# Altium project XRACER-R07.PrjPCB
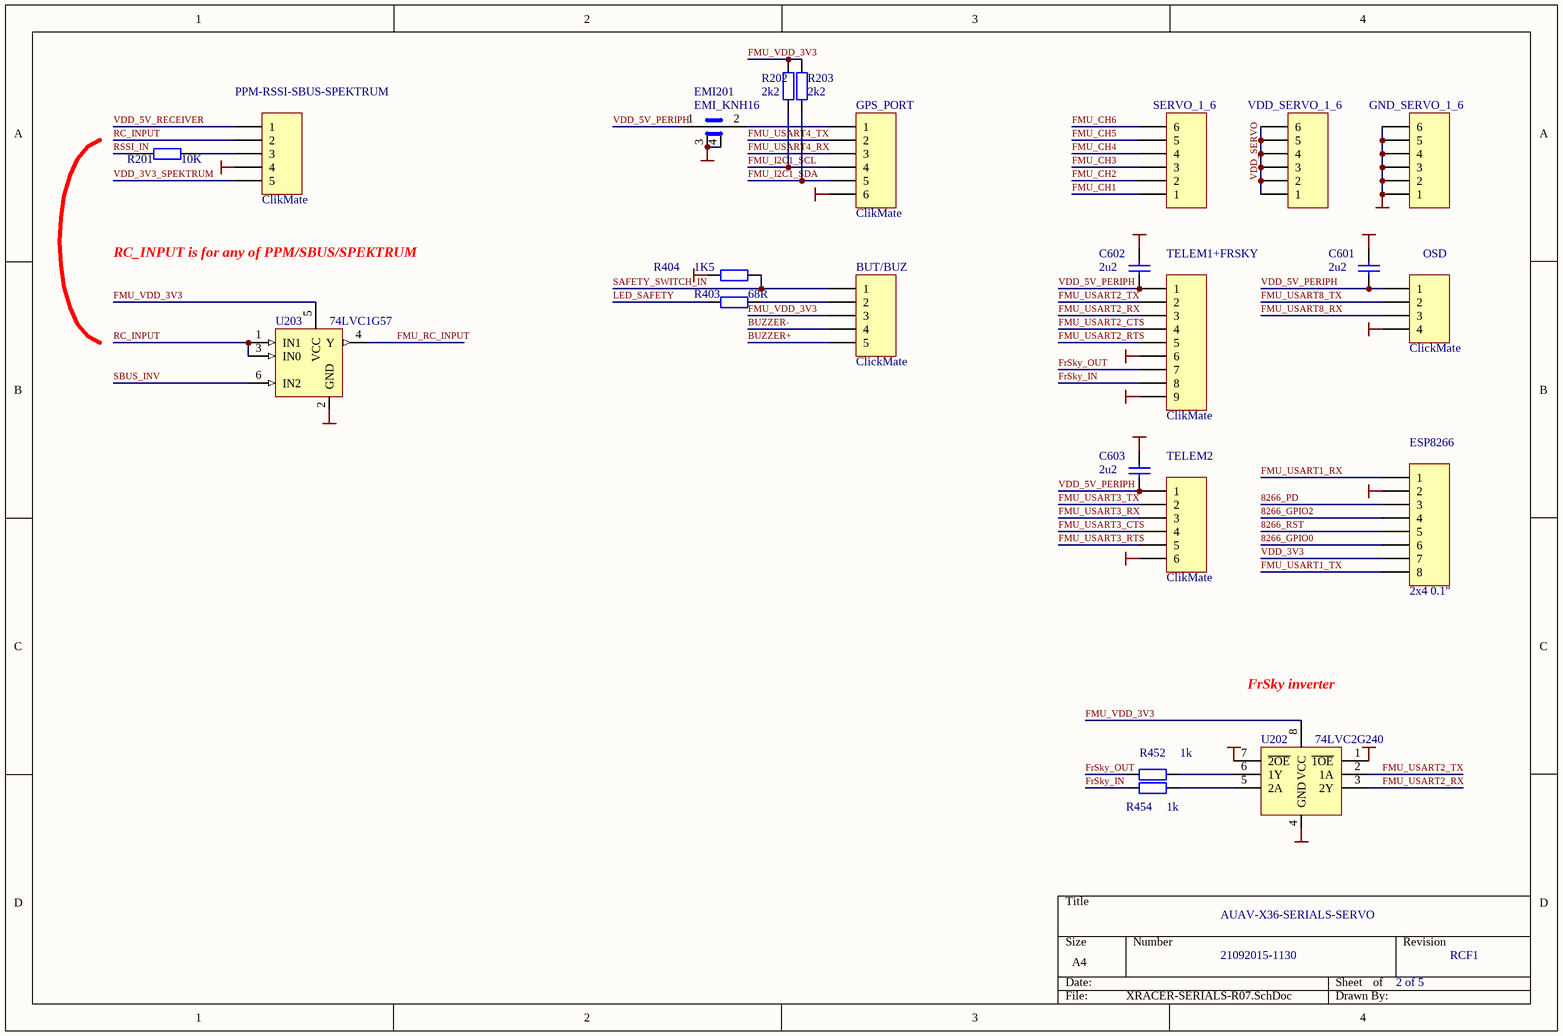
[diagram p0: XRACER-SERIALS-R07.SchDoc]
1 sheet, 23 parts. Net scope: global (net labels, ports and power ports of the same name join across sheets).
Board file: XRACER-R07.PcbDoc

## Sheet XRACER-SERIALS-R07.SchDoc
size A4

### Parts
BUT/BUZ  ClickMate  [Molex_Clik_1.25_5H]
C601  2u2  [0402A]
C602  2u2  [0402A]
C603  2u2  [0402A]
EMI201  EMI_KNH16  [EMI_KNH16_0603]
ESP8266  2x4 0.1"  [2.54mm_2x4_SMD_female]
GND_SERVO_1_6  Header 6  [HDR1X6]  (value not drawn)
GPS_PORT  ClikMate  [Molex_Clok_1.25_6H]
OSD  ClickMate  [Molex_1.25_click_4]
PPM-RSSI-SBUS-SPEKTRUM  ClikMate  [Molex_Clik_1.25_5H]
R201  10K  [0402A]
R202  2k2  [0402A]
R203  2k2  [0402A]
R403  68R  [0402A]
R404  1K5  [0402A]
R452  1k  [0402A]
R454  1k  [0402A]
SERVO_1_6  Header 6  [HDR1X6]  (value not drawn)
TELEM1+FRSKY  ClikMate  [Molex_Click_1.25_9H]
TELEM2  ClikMate  [Molex_Clok_1.25_6H]
U202  74LVC2G240  [ssop-8]
U203  74LVC1G57  [sot323-6]
VDD_SERVO_1_6  Header 6  [HDR1X6]  (value not drawn)

### Nets
GND: C601.2 C602.2 C603.2 EMI201.3(G) EMI201.4(G) ESP8266.2 GND_SERVO_1_6.1 GND_SERVO_1_6.2 GND_SERVO_1_6.3 GND_SERVO_1_6.4 GND_SERVO_1_6.5 GND_SERVO_1_6.6 GPS_PORT.6 OSD.4 PPM-RSSI-SBUS-SPEKTRUM.4 R404.2 TELEM1+FRSKY.6 TELEM1+FRSKY.9 TELEM2.6 U202.1(~{1OE}) U202.4(GND) U202.7(~{2OE}) U203.2(GND)
8266_GPIO0: ESP8266.6
8266_GPIO2: ESP8266.4
8266_PD: ESP8266.3
8266_RST: ESP8266.5
BUZZER+: BUT/BUZ.5
BUZZER-: BUT/BUZ.4
FMU_CH1: SERVO_1_6.1
FMU_CH2: SERVO_1_6.2
FMU_CH3: SERVO_1_6.3
FMU_CH4: SERVO_1_6.4
FMU_CH5: SERVO_1_6.5
FMU_CH6: SERVO_1_6.6
FMU_I2C1_SCL: GPS_PORT.4 R202.2
FMU_I2C1_SDA: GPS_PORT.5 R203.2
FMU_RC_INPUT: U203.4(Y)
FMU_USART1_RX: ESP8266.1
FMU_USART1_TX: ESP8266.8
FMU_USART2_CTS: TELEM1+FRSKY.4
FMU_USART2_RTS: TELEM1+FRSKY.5
FMU_USART2_RX: TELEM1+FRSKY.3 U202.3(2Y)
FMU_USART2_TX: TELEM1+FRSKY.2 U202.2(1A)
FMU_USART3_CTS: TELEM2.4
FMU_USART3_RTS: TELEM2.5
FMU_USART3_RX: TELEM2.3
FMU_USART3_TX: TELEM2.2
FMU_USART4_RX: GPS_PORT.3
FMU_USART4_TX: GPS_PORT.2
FMU_USART8_RX: OSD.3
FMU_USART8_TX: OSD.2
FMU_VDD_3V3: BUT/BUZ.3 R202.1 R203.1 U202.8(VCC) U203.5(VCC)
FrSky_IN: R454.1 TELEM1+FRSKY.8
FrSky_OUT: R452.1 TELEM1+FRSKY.7
LED_SAFETY: R403.2
RC_INPUT: PPM-RSSI-SBUS-SPEKTRUM.2 U203.1(IN1) U203.3(IN0)
RSSI_IN: R201.2
SAFETY_SWITCH_IN: BUT/BUZ.1 R404.1
SBUS_INV: U203.6(IN2)
VDD_3V3: ESP8266.7
VDD_3V3_SPEKTRUM: PPM-RSSI-SBUS-SPEKTRUM.5
VDD_5V_PERIPH: C601.1 C602.1 C603.1 EMI201.1(L1) OSD.1 TELEM1+FRSKY.1 TELEM2.1
VDD_5V_RECEIVER: PPM-RSSI-SBUS-SPEKTRUM.1
VDD_SERVO: VDD_SERVO_1_6.1 VDD_SERVO_1_6.2 VDD_SERVO_1_6.3 VDD_SERVO_1_6.4 VDD_SERVO_1_6.5 VDD_SERVO_1_6.6
NetBUT/BUZ_2: BUT/BUZ.2 R403.1
NetEMI201_2: EMI201.2(L2) GPS_PORT.1
NetPPM-RSSI-SBUS-SPEKTRUM_3: PPM-RSSI-SBUS-SPEKTRUM.3 R201.1
NetR452_2: R452.2 U202.6(1Y)
NetR454_2: R454.2 U202.5(2A)

### Notes on the sheet
- RC_INPUT is for any of PPM/SBUS/SPEKTRUM
- FrSky inverter
- AUAV-X36-SERIALS-SERVO
- 21092015-1130
- 2 of 5
- RCF1

### Library data of the parts
BUT/BUZ PPM-RSSI-SBUS-SPEKTRUM = Header 5: Header, 5-Pin; LatestRevisionDate: 17-Jul-2002; LatestRevisionNote: Re-released for DXP Platform.; Publisher: Altium Limited
C601-C603 = Cap: Capacitor; Value: 100pF; Published: 8-Jun-2000; LatestRevisionDate: 17-Jul-2002; LatestRevisionNote: Re-released for DXP Platform.; PackageReference: RAD-0.3; Publisher: Altium Limited
ESP8266 = Header 8: Header, 8-Pin; LatestRevisionDate: 17-Jul-2002; LatestRevisionNote: Re-released for DXP Platform.; Publisher: Altium Limited
GND_SERVO_1_6 GPS_PORT SERVO_1_6 TELEM2 VDD_SERVO_1_6 = Header 6: Header, 6-Pin; LatestRevisionDate: 17-Jul-2002; LatestRevisionNote: Re-released for DXP Platform.; Publisher: Altium Limited
OSD = Header 4: Header, 4-Pin; LatestRevisionDate: 17-Jul-2002; LatestRevisionNote: Re-released for DXP Platform.; Publisher: Altium Limited
R201-R203 R403 R404 = Res2: Resistor; Value: 1K; Published: 8-Jun-2000; LatestRevisionDate: 17-Jul-2002; LatestRevisionNote: Re-released for DXP Platform.; PackageReference: AXIAL-0.4; Publisher: Altium Limited
  R202 R203: PackageDescription: Axial Device, Thru-Hole; 2 Leads; 0.4 in Pin Spacing
R452 R454 = Res2: Resistor; Published: 8-Jun-2000; LatestRevisionDate: 17-Jul-2002; LatestRevisionNote: Re-released for DXP Platform.; PackageReference: AXIAL-0.4; Publisher: Altium Limited; PackageDescription: Axial Device, Thru-Hole; 2 Leads; 0.4 in Pin Spacing; Value: 1K
TELEM1+FRSKY = Header 9: Header, 9-Pin; LatestRevisionDate: 17-Jul-2002; LatestRevisionNote: Re-released for DXP Platform.; Publisher: Altium Limited